# EAGLE design mcb_mini44 (EAGLE 5.09)
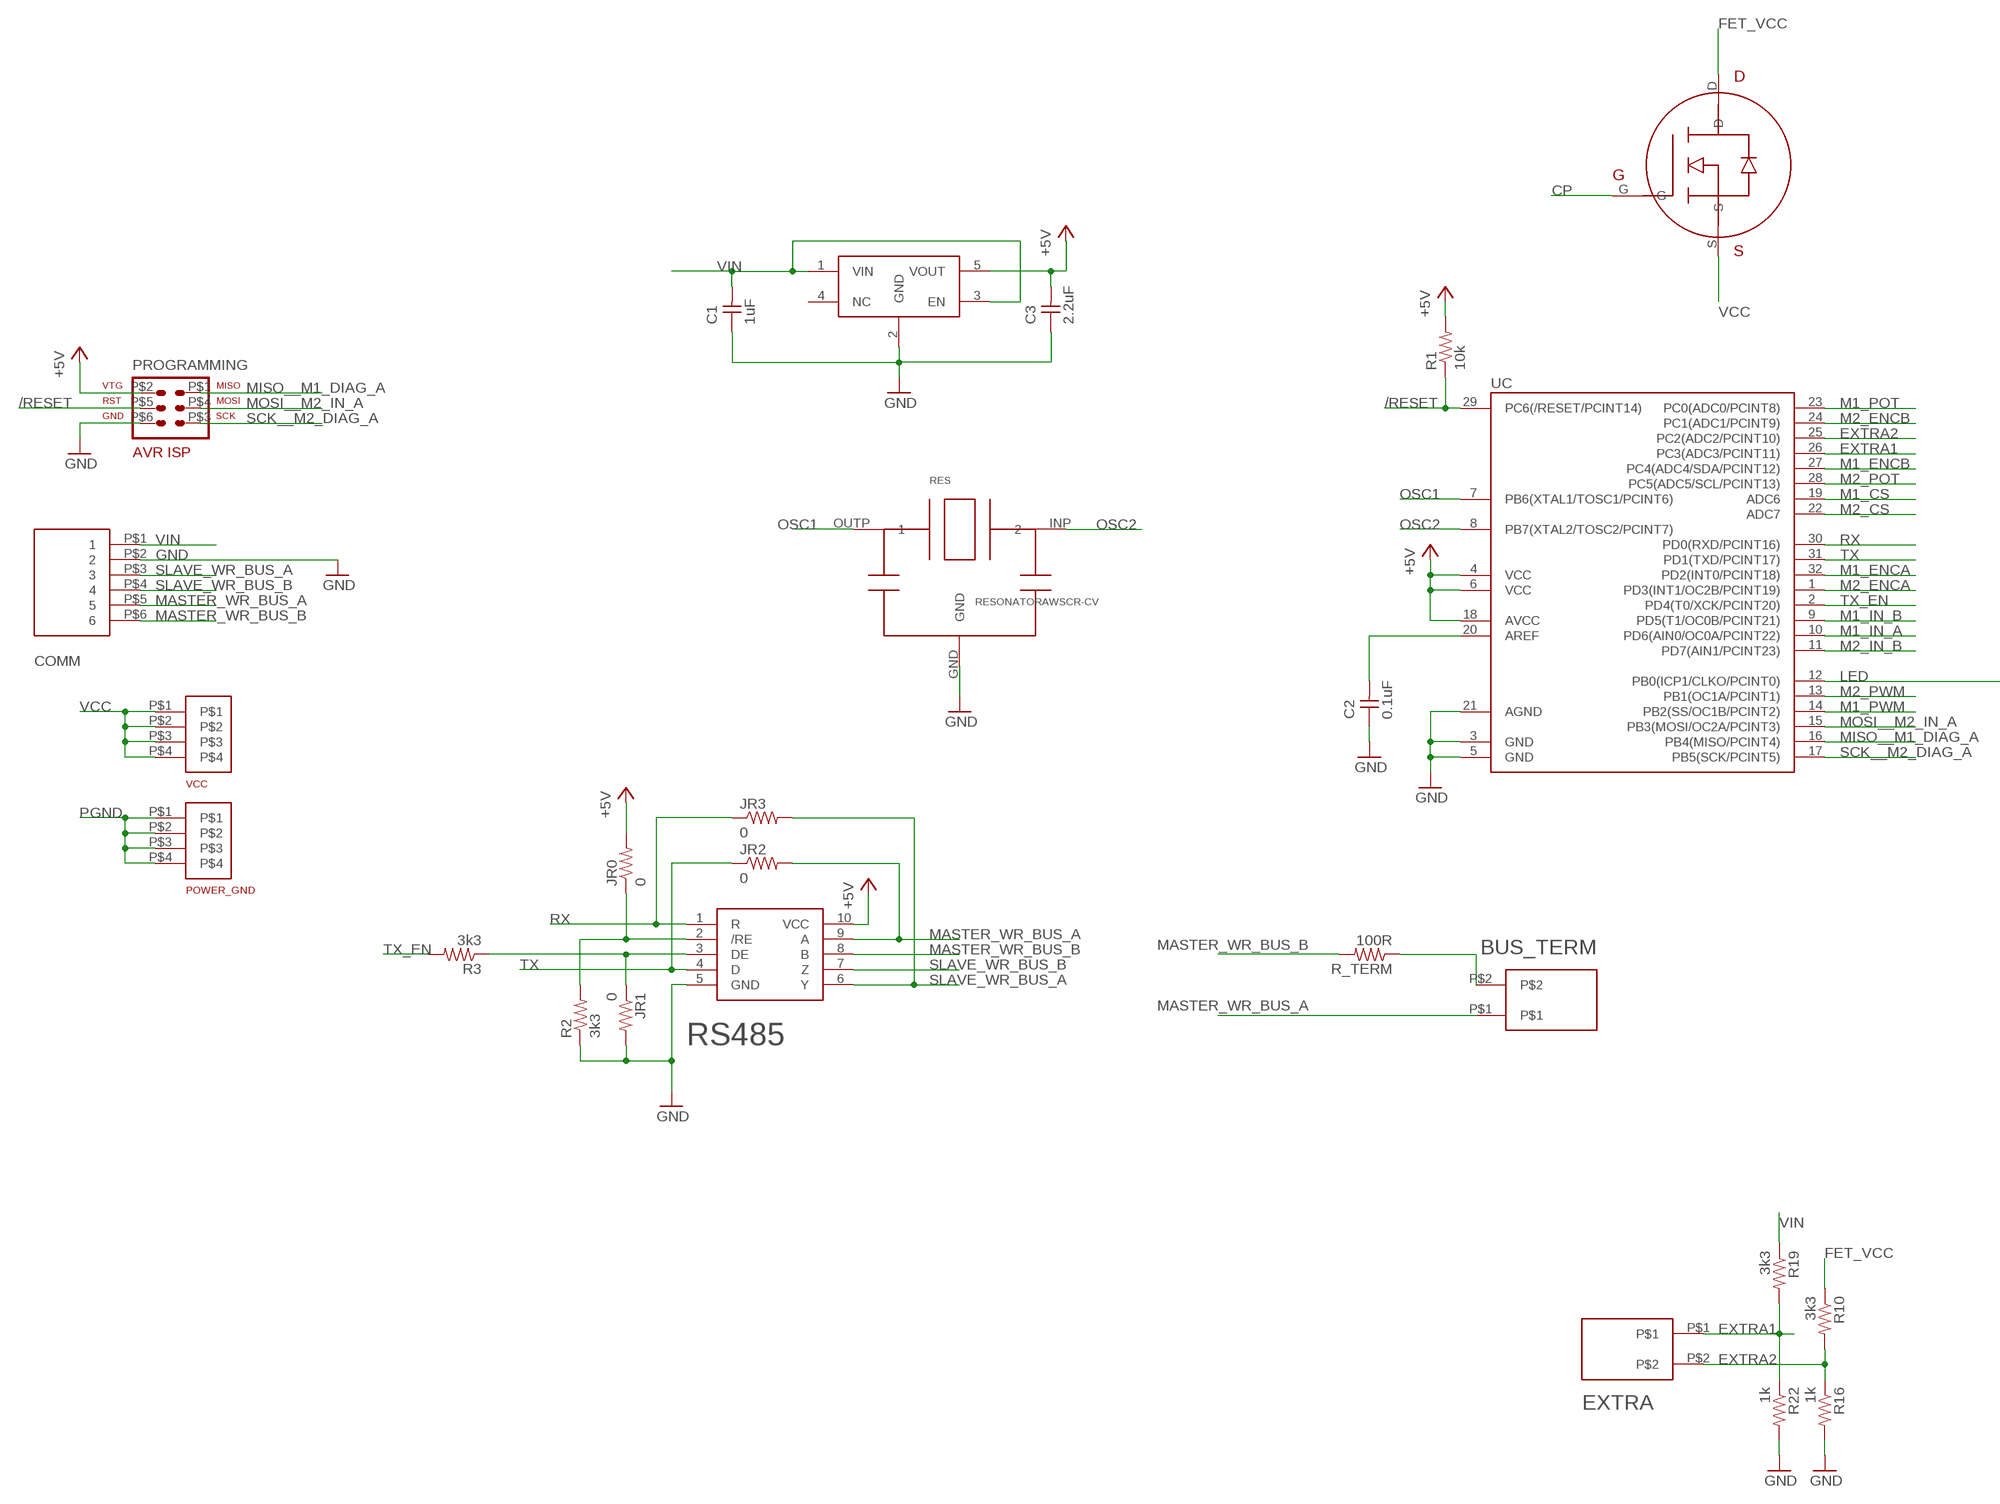
[diagram p0: schematic, sheet 1, part 1 of 2]
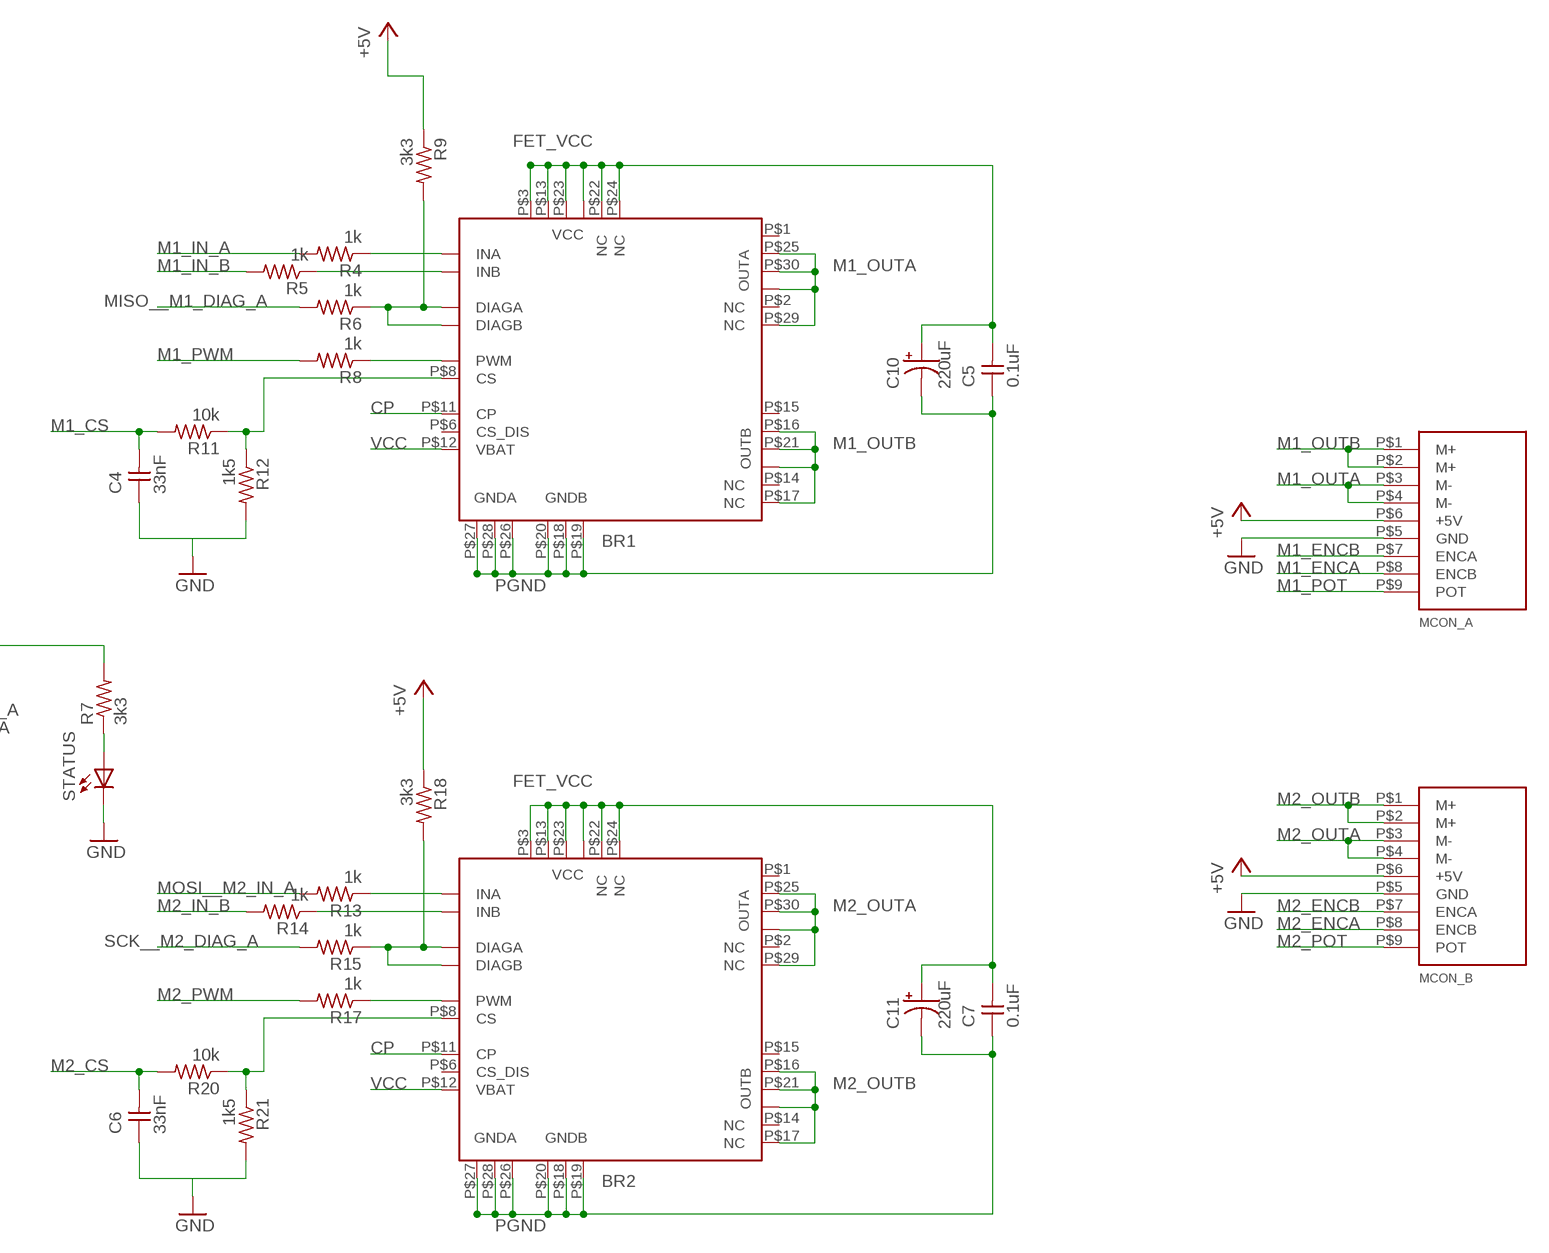
[diagram p1: schematic, sheet 1, part 2 of 2]

## Parts
BR1  VNH5019A-E  [MULTIPOWERSO-30-SIGGI]
BR2  VNH5019A-E  [MULTIPOWERSO-30-SIGGI]
BUS_TERM  2PIN-100MILL  [2-PIN-100MIL]
C1  1uF  CAPACITOR0603  [0603]
C2  0.1uF  CAPACITOR0603  [0603]
C3  2.2uF  CAPACITOR0603  [0603]
C4  33nF  CAPACITOR0603  [0603]
C5  0.1uF  CAPACITOR0603  [0603]
C6  33nF  CAPACITOR0603  [0603]
C7  0.1uF  CAPACITOR0603  [0603]
C10  220uF  CAP-EMVY350ADA221MHA0G  [HAO]
C11  220uF  CAP-EMVY350ADA221MHA0G  [HAO]
COMM  6PIN-RIBBONCABLE-BOARDHEADER  [6PIN-HEADER-DUALROW]
EXTRA  2PIN-100MILL  [2-PIN-100MIL]
FET  MOSFET-N-FDD8896  [TO-252]
JR0  0  RESISTOR0603  [0603]
JR1  0  RESISTOR0603  [0603]
JR2  0  RESISTOR0603  [0603]
JR3  0  RESISTOR0603  [0603]
MCON_A  9-PIN-MOTOR_CONNECTOR  [9-PIN-2.54MM-TERMINAL-BLOCK]
MCON_B  9-PIN-MOTOR_CONNECTOR  [9-PIN-2.54MM-TERMINAL-BLOCK]
POWER_GND  SCREW_TERMINAL_7700K  [SCREW_TERM_7700K]
PROGRAMMING  AVR-ISP-6SURFACE_MOUNT  [SMD6]
R1  10k  RESISTOR0603  [0603]
R2  3k3  RESISTOR0603  [0603]
R3  3k3  RESISTOR0603  [0603]
R4  1k  RESISTOR0603  [0603]
R5  1k  RESISTOR0603  [0603]
R6  1k  RESISTOR0603  [0603]
R7  3k3  RESISTOR0603  [0603]
R8  1k  RESISTOR0603  [0603]
R9  3k3  RESISTOR0603  [0603]
R10  3k3  RESISTOR0603  [0603]
R11  10k  RESISTOR0603  [0603]
R12  1k5  RESISTOR0603  [0603]
R13  1k  RESISTOR0603  [0603]
R14  1k  RESISTOR0603  [0603]
R15  1k  RESISTOR0603  [0603]
R16  1k  RESISTOR0603  [0603]
R17  1k  RESISTOR0603  [0603]
R18  3k3  RESISTOR0603  [0603]
R19  3k3  RESISTOR0603  [0603]
R20  10k  RESISTOR0603  [0603]
R21  1k5  RESISTOR0603  [0603]
R22  1k  RESISTOR0603  [0603]
R_TERM  100R  RESISTOR0603  [0603]
RES  RESONATORAWSCR-CV  [AWSCR-CV]
RS485  RS485-SN65HVD3086EDGSR  [MSOP-10]
STATUS  LED1206  [CHIPLED_1206]
UC  MEGA48/88/168-AU  [TQFP32-08]
VCC  SCREW_TERMINAL_7700K  [SCREW_TERM_7700K]
VREG  MIC5235  [SOT-23-5]

## Nets
+1.1V: C2.2 UC.20(AREF)
+5V: C3.2 JR0.2 MCON_A.P$6(+5V) MCON_B.P$6(+5V) PROGRAMMING.P$2 R1.2 R9.1 R18.1 RS485.10(VCC) UC.4(VCC) UC.6(VCC) UC.18(AVCC) VREG.5(VOUT)
/RESET: PROGRAMMING.P$5 R1.1 UC.29(PC6(/RESET/PCINT14))
CP: BR1.P$11(CP) BR2.P$11(CP) FET.G
EXTRA1: EXTRA.P$1 R19.2 R22.1 UC.26(PC3(ADC3/PCINT11))
EXTRA2: EXTRA.P$2 R10.2 R16.1 UC.25(PC2(ADC2/PCINT10))
FET_VCC: BR1.P$3(VCC) BR1.P$13(VCC) BR1.P$22(NC) BR1.P$23(VCC) BR1.P$24(NC) BR1.VCC_SLUG(VCC) BR2.P$3(VCC) BR2.P$13(VCC) BR2.P$22(NC) BR2.P$23(VCC) BR2.P$24(NC) BR2.VCC_SLUG(VCC) C5.2 C7.2 C10.+ C11.+ FET.D R10.1
GND: C1.1 C2.1 C3.1 C4.1 C6.1 COMM.P$2 JR1.2 MCON_A.P$5(GND) MCON_B.P$5(GND) PROGRAMMING.P$6 R2.1 R12.2 R16.2 R21.2 R22.2 RES.GND RS485.5(GND) STATUS.C UC.3(GND) UC.5(GND) UC.21(AGND) VREG.2(GND)
LED: R7.2 UC.12(PB0(ICP1/CLKO/PCINT0))
M1_CS: C4.2 R11.2 UC.19(ADC6)
M1_ENCA: MCON_A.P$8(ENCB) UC.32(PD2(INT0/PCINT18))
M1_ENCB: MCON_A.P$7(ENCA) UC.27(PC4(ADC4/SDA/PCINT12))
M1_IN_A: R4.2 UC.10(PD6(AIN0/OC0A/PCINT22))
M1_IN_B: R5.2 UC.9(PD5(T1/OC0B/PCINT21))
M1_OUTA: BR1.OUTA_SLUG(OUTA) BR1.P$25(OUTA) BR1.P$29(NC) BR1.P$30(OUTA) MCON_A.P$3(M-) MCON_A.P$4(M-)
M1_OUTB: BR1.OUTB_SLUG(OUTB) BR1.P$16(OUTB) BR1.P$17(NC) BR1.P$21(OUTB) MCON_A.P$1(M+) MCON_A.P$2(M+)
M1_POT: MCON_A.P$9(POT) UC.23(PC0(ADC0/PCINT8))
M1_PWM: R8.2 UC.14(PB2(SS/OC1B/PCINT2))
M2_CS: C6.2 R20.2 UC.22(ADC7)
M2_ENCA: MCON_B.P$8(ENCB) UC.1(PD3(INT1/OC2B/PCINT19))
M2_ENCB: MCON_B.P$7(ENCA) UC.24(PC1(ADC1/PCINT9))
M2_IN_B: R14.2 UC.11(PD7(AIN1/PCINT23))
M2_OUTA: BR2.OUTA_SLUG(OUTA) BR2.P$25(OUTA) BR2.P$29(NC) BR2.P$30(OUTA) MCON_B.P$3(M-) MCON_B.P$4(M-)
M2_OUTB: BR2.OUTB_SLUG(OUTB) BR2.P$16(OUTB) BR2.P$17(NC) BR2.P$21(OUTB) MCON_B.P$1(M+) MCON_B.P$2(M+)
M2_POT: MCON_B.P$9(POT) UC.28(PC5(ADC5/SCL/PCINT13))
M2_PWM: R17.2 UC.13(PB1(OC1A/PCINT1))
MASTER_WR_BUS_A: BUS_TERM.P$1 COMM.P$5 JR2.2 RS485.9(A)
MASTER_WR_BUS_B: COMM.P$6 R_TERM.2 RS485.8(B)
MISO__M1_DIAG_A: PROGRAMMING.P$1 R6.2 UC.16(PB4(MISO/PCINT4))
MOSI__M2_IN_A: PROGRAMMING.P$4 R13.2 UC.15(PB3(MOSI/OC2A/PCINT3))
N$2: BR2.P$4(INA) R13.1
N$3: JR0.1 R2.2 RS485.2(/RE)
N$4: JR1.1 R3.1 RS485.3(DE)
N$5: BR1.P$8(CS) R11.1 R12.1
N$6: BR2.P$10(INB) R14.1
N$8: BR2.P$5(DIAGA) BR2.P$9(DIAGB) R15.1 R18.2
N$9: BR2.P$7(PWM) R17.1
N$10: BR1.P$4(INA) R4.1
N$11: BR1.P$10(INB) R5.1
N$12: R7.1 STATUS.A
N$13: BR1.P$5(DIAGA) BR1.P$9(DIAGB) R6.1 R9.2
N$14: BR1.P$7(PWM) R8.1
N$15: BR2.P$8(CS) R20.1 R21.1
N$16: BUS_TERM.P$2 R_TERM.1
OSC1: RES.OUTP UC.7(PB6(XTAL1/TOSC1/PCINT6))
OSC2: RES.INP UC.8(PB7(XTAL2/TOSC2/PCINT7))
PGND: BR1.P$18(GNDB) BR1.P$19(GNDB) BR1.P$20(GNDB) BR1.P$26(GNDA) BR1.P$27(GNDA) BR1.P$28(GNDA) BR2.P$18(GNDB) BR2.P$19(GNDB) BR2.P$20(GNDB) BR2.P$26(GNDA) BR2.P$27(GNDA) BR2.P$28(GNDA) C5.1 C7.1 C10.- C11.- POWER_GND.P$1 POWER_GND.P$2 POWER_GND.P$3 POWER_GND.P$4
RX: JR3.1 RS485.1(R) UC.30(PD0(RXD/PCINT16))
SCK__M2_DIAG_A: PROGRAMMING.P$3 R15.2 UC.17(PB5(SCK/PCINT5))
SLAVE_WR_BUS_A: COMM.P$3 JR3.2 RS485.6(Y)
SLAVE_WR_BUS_B: COMM.P$4 RS485.7(Z)
TX: JR2.1 RS485.4(D) UC.31(PD1(TXD/PCINT17))
TX_EN: R3.2 UC.2(PD4(T0/XCK/PCINT20))
VCC: BR1.P$12(VBAT) BR2.P$12(VBAT) FET.S VCC.P$1 VCC.P$2 VCC.P$3 VCC.P$4
VIN: C1.2 COMM.P$1 R19.1 VREG.1(VIN) VREG.3(EN)
Unconnected: BR1.P$1(OUTA) BR1.P$2(NC) BR1.P$6(CS_DIS) BR1.P$14(NC) BR1.P$15(OUTB) BR2.P$1(OUTA) BR2.P$2(NC) BR2.P$6(CS_DIS) BR2.P$14(NC) BR2.P$15(OUTB) VREG.4(NC)

## Library data of the parts
BR1 BR2 = st-microelectronics:VNH5019A-E
BUS_TERM EXTRA = soa:2PIN-100MILL
C1-C7 = huggable:CAPACITOR
C10 C11 = soa:CAP-EMVY350ADA221MHA0G
COMM = soa:6PIN-RIBBONCABLE-BOARDHEADER
FET = soa:MOSFET-N-FDD8896
JR0 JR1-JR3 R1-R22 R_TERM = huggable:RESISTOR
MCON_A MCON_B = soa:9-PIN-MOTOR_CONNECTOR
POWER_GND VCC = soa:SCREW_TERMINAL_7700K
PROGRAMMING = avr-4:AVR-ISP-6: AVR ISP-6 Serial Programming Header
RES = soa:RESONATOR
RS485 = soa:RS485-SN65HVD3086EDGSR
STATUS = huggable:LED
UC = avr-4:MEGA48/88/168
VREG = soa:MIC5235

## Board
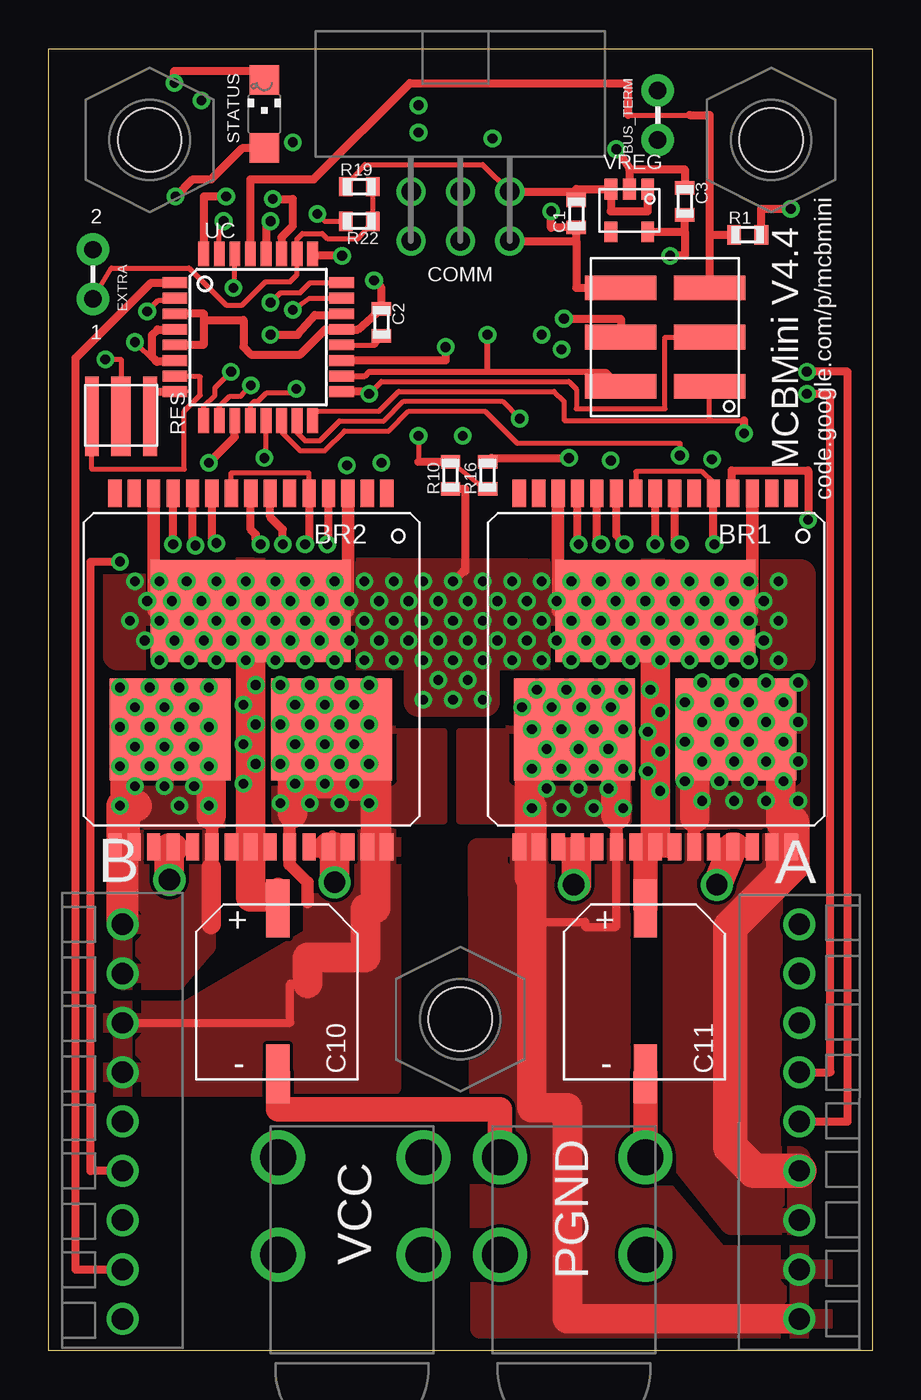
[diagram p2: board, top side]
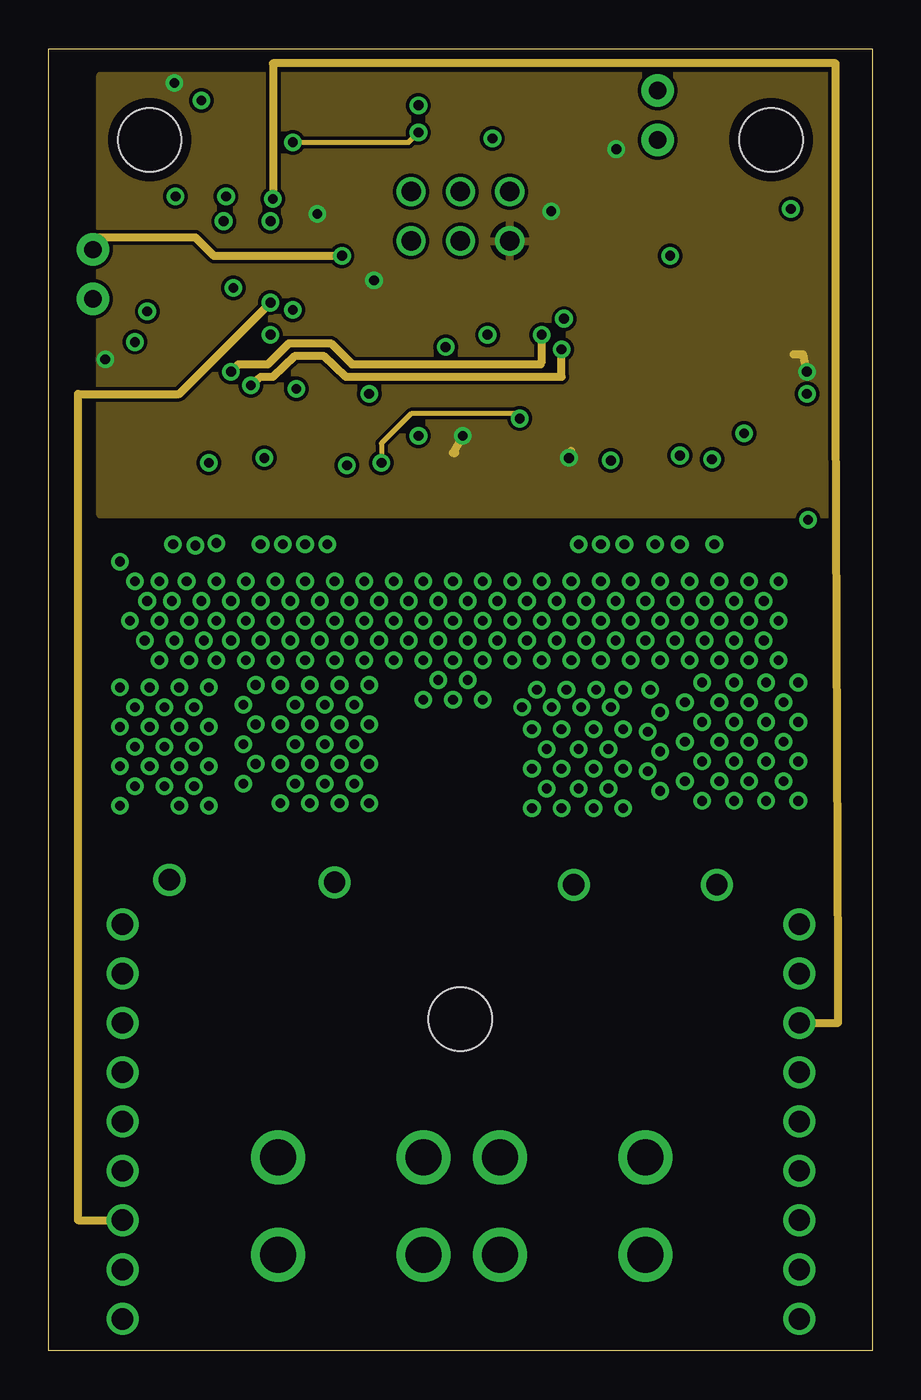
[diagram p3: board, inner layer SIGNAL]
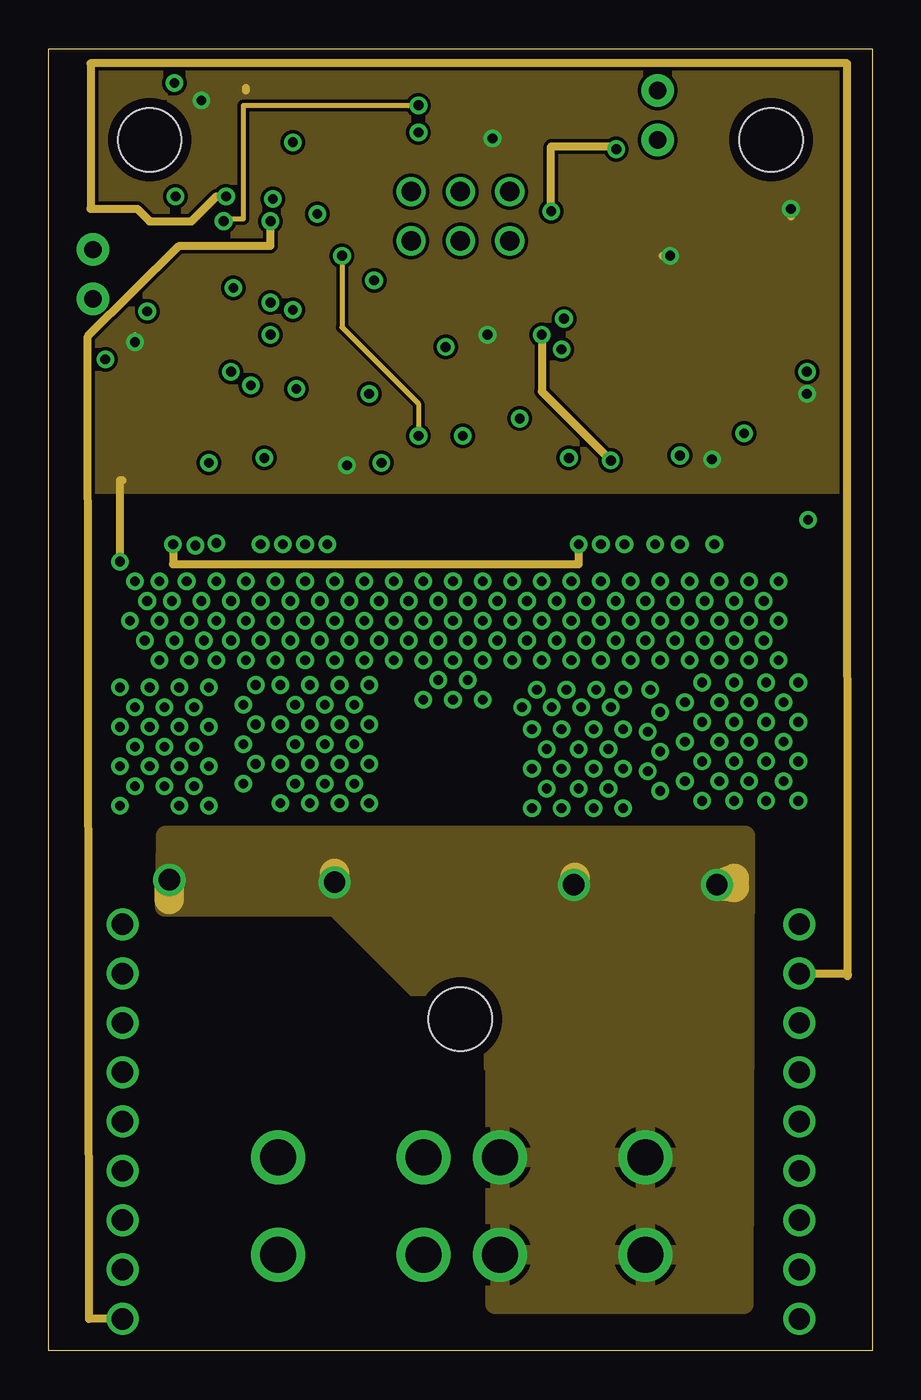
[diagram p4: board, inner layer VCC]
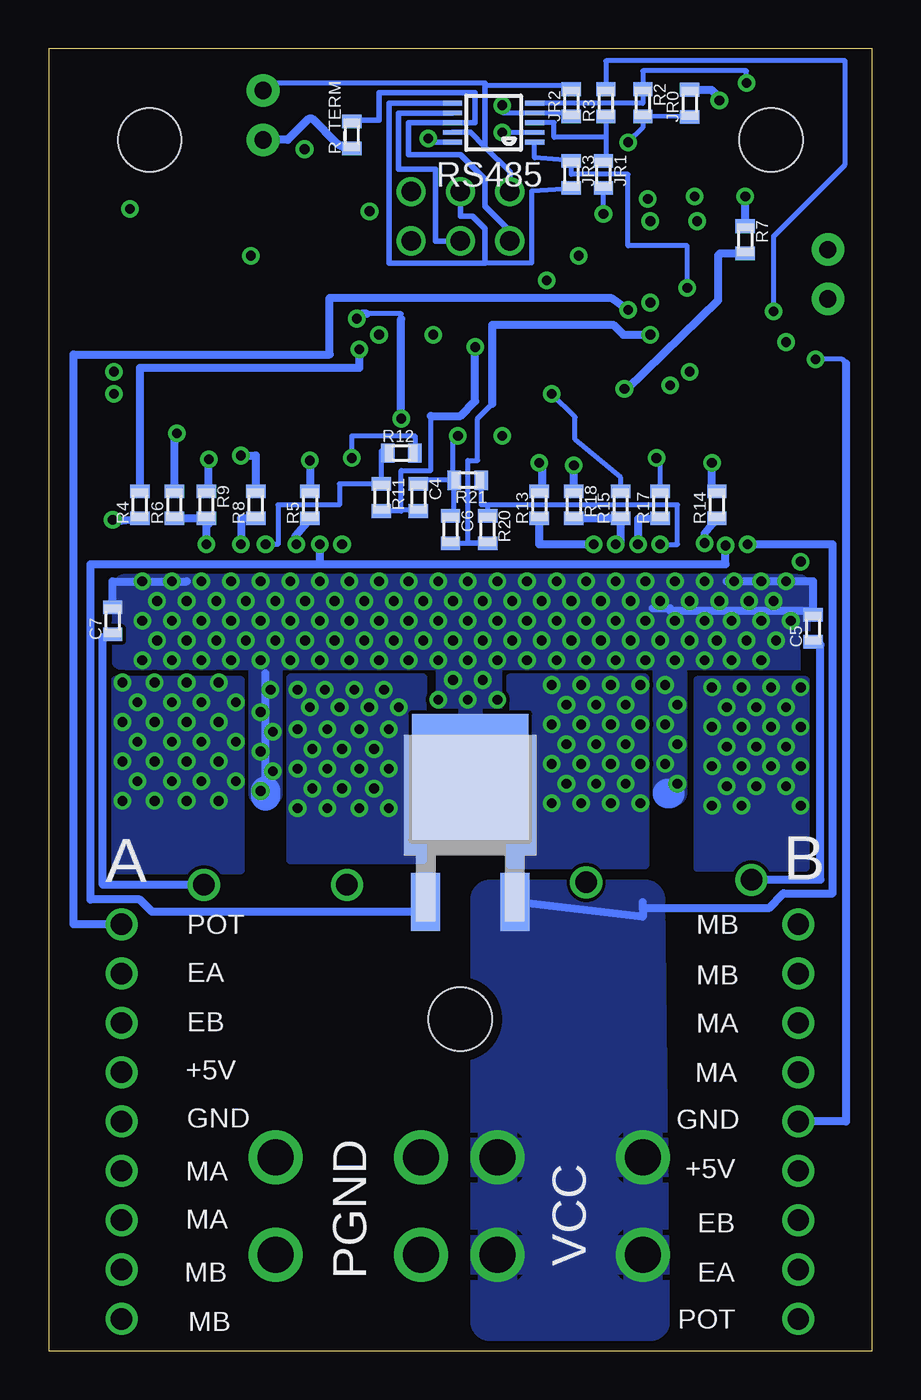
[diagram p5: board, bottom side, seen from below]

Size 42.42 x 67.06 mm. Coordinates in mm from the lower left corner, seen from the top.
Outline: 0,67.06 42.42,67.06 42.42,0 0,0 0,67.06
Copper layers (1*2+3*16): SIGNAL_TOP 0.0356mm / dielectric 1.5011mm / SIGNAL 0.0356mm / dielectric 0.1499mm / VCC 0.0356mm / dielectric 0.2007mm / GND 0.0356mm
Design rules "SilverCircuits_DesignRules *": minimum track width 7mil, minimum drill 14mil, track to track 7mil, track to pad 7mil, pad to pad 7mil, via to via 7mil, smd to smd 0mil, copper to edge 20mil, drill to drill 8mil, minimum pad ring 10mil, minimum via ring 8mil, stop-mask expansion 4mil, vias tented up to drill 0mil, thermal gap 10mil

### Footprints (pad centres in the part's own frame; a part is rotated, then mirrored left to right if it is on the bottom)
MULTIPOWERSO-30-SIGGI = smd 6.23 x 5.25: OUTA_SLUG -4.15,3.05; OUTB_SLUG 4.15,3.05 | smd 0.68 x 1.4: P$1 -7,-9.1; P$2 -6,-9.1; P$3 -5,-9.1; P$4 -4,-9.1; P$5 -3,-9.1; P$6 -2,-9.1; P$7 -1,-9.1; P$8 0,-9.1; P$9 1,-9.1; P$10 2,-9.1; P$11 3,-9.1; P$12 4,-9.1; P$13 5,-9.1; P$14 6,-9.1; P$15 7,-9.1; P$16 7,9.1; P$17 6,9.1; P$18 5,9.1; P$19 4,9.1; P$20 3,9.1; P$21 2,9.1; P$22 1,9.1; P$23 0,9.1; P$24 -1,9.1; P$25 -2,9.1; P$26 -3,9.1; P$27 -4,9.1; P$28 -5,9.1; P$29 -6,9.1; P$30 -7,9.1 | smd 10.3 x 5.25: VCC_SLUG 0,-3.05
2-PIN-100MIL = drill 0.889 pad 1.676 round: P$1 0,0; P$2 2.54,0
0603 = smd 0.7 x 1: 1 -0.7,0; 2 0.7,0
HAO = smd 1.2 x 3: + 0,5; - 0,-3.5
6PIN-HEADER-DUALROW = drill 1 round: P$1 -2.54,0; P$2 -2.54,2.54; P$3 0,0; P$4 0,2.54; P$5 2.54,0; P$6 2.54,2.54
TO-252 = smd 6 x 6.5: D 0,6.44 | smd 1.5 x 3: G -2.3,0; S 2.3,0
9-PIN-2.54MM-TERMINAL-BLOCK = drill 1.1 round: P$1 0,0; P$2 2.54,0; P$3 5.08,0; P$4 7.62,0; P$5 10.16,0; P$6 12.7,0; P$7 15.24,0; P$8 17.78,0; P$9 20.32,0
SCREW_TERM_7700K = drill 1.854 round: P$1 -3.81,2.032; P$2 3.683,2.032; P$3 -3.81,-2.972; P$4 3.683,-2.972
SMD6 = smd 3.68 x 1.27: P$1 -2.286,2.54; P$2 2.286,2.54; P$3 -2.286,0; P$4 2.286,0; P$5 -2.286,-2.54; P$6 2.286,-2.54
AWSCR-CV = smd 1 x 4.1: GND 0,0 | smd 0.7 x 4.1: INP -1.5,0; OUTP 1.5,0
MSOP-10 = smd 0.25 x 1: 1 -0.88,-2.423; 2 -0.38,-2.423; 3 0.12,-2.423; 4 0.62,-2.423; 5 1.12,-2.423; 6 1.12,1.803; 7 0.62,1.803; 8 0.12,1.803; 9 -0.38,1.803; 10 -0.88,1.803
CHIPLED_1206 = smd 1.5 x 1.5: A 0,-1.75; C 0,1.75
4-40_NUT_DRILL = hole 3.264: 0,0
TQFP32-08 = smd 1.27 x 0.559: 1 -4.293,2.8; 2 -4.293,2; 3 -4.293,1.2; 4 -4.293,0.4; 5 -4.293,-0.4; 6 -4.293,-1.2; 7 -4.293,-2; 8 -4.293,-2.8; 17 4.293,-2.8; 18 4.293,-2; 19 4.293,-1.2; 20 4.293,-0.4; 21 4.293,0.4; 22 4.293,1.2; 23 4.293,2; 24 4.293,2.8 | smd 0.559 x 1.27: 9 -2.8,-4.293; 10 -2,-4.293; 11 -1.2,-4.293; 12 -0.4,-4.293; 13 0.4,-4.293; 14 1.2,-4.293; 15 2,-4.293; 16 2.8,-4.293; 25 2.8,4.293; 26 2,4.293; 27 1.2,4.293; 28 0.4,4.293; 29 -0.4,4.293; 30 -1.2,4.293; 31 -2,4.293; 32 -2.8,4.293
SOT-23-5 = smd 0.65 x 1.06: 1 0,0; 2 0.95,0; 3 1.9,0; 4 1.9,2.2; 5 0,2.2

### Placement (x,y rotation side)
BR1  31.24,35.05 180 top
BR2  10.41,35.05 180 top
BUS_TERM  31.37,64.9 270 top
C1  27.18,58.55 90 top
C2  17.14,52.96 270 top
C3  32.77,59.18 270 top
C4  23.37,43.94 270 bottom
C5  3.05,37.21 90 bottom
C6  21.72,42.29 270 bottom
C7  39.12,37.59 90 bottom
C10  11.81,17.78 0 top
C11  30.73,17.78 0 top
COMM  21.21,59.69 180 top
EXTRA  2.29,54.17 90 top
FET  20.7,23.11 0 bottom
JR0  9.4,64.24 90 bottom
JR1  13.84,60.58 270 bottom
JR2  15.49,64.26 90 bottom
JR3  15.49,60.58 270 bottom
MCON_A  38.66,1.65 90 top
MCON_B  3.81,21.97 270 top
POWER_GND  26.92,6.98 180 top
PROGRAMMING  31.75,52.2 180 top
R1  36,57.47 0 top
R2  11.81,64.26 270 bottom
R3  13.72,64.26 90 bottom
R4  37.72,43.56 90 bottom
R5  28.96,43.56 90 bottom
R6  35.94,43.56 90 bottom
R7  6.54,57.21 270 bottom
R8  31.75,43.56 90 bottom
R9  34.29,43.56 270 bottom
R10  20.7,45.08 90 top
R11  25.27,43.94 270 bottom
R12  24.26,46.23 0 bottom
R13  17.14,43.56 90 bottom
R14  8,43.56 90 bottom
R15  12.95,43.56 90 bottom
R16  22.61,45.08 90 top
R17  10.92,43.56 90 bottom
R18  15.37,43.56 270 bottom
R19  16,59.94 0 top
R20  19.81,42.29 270 bottom
R21  20.83,44.83 180 bottom
R22  16,58.17 180 top
R_TERM  26.8,62.61 90 bottom
RES  3.73,48.12 180 top
RS485  19.81,63.12 90 bottom
STATUS  11.11,63.69 0 top
U$3  [4-40_NUT_DRILL]  21.21,17.09 0 top
U$10  [4-40_NUT_DRILL]  5.21,62.36 0 top
U$14  [4-40_NUT_DRILL]  37.21,62.36 0 top
UC  10.8,52.2 0 top
VCC  15.49,6.98 180 top
VREG  30.86,59.82 180 top

### Tracks (layer width: path | path; a pad name or v marks a point on that pad's centre or on a via)
+1.1V
  SIGNAL_TOP 0.254: UC.20 16.83,51.8 C2.2
+5V  (via drill 0.5)
  SIGNAL_TOP 0.254: 6.43,50.93 5.46,50.93 v4.45,51.94
  SIGNAL_TOP 0.305: PROGRAMMING.P$2 28.7,50.42 22.61,50.42 | 22.61,50.42 v22.61,52.32 | UC.18 16.29,50.2 16.51,50.42 22.61,50.42
  SIGNAL_TOP 0.406: 32.77,57.62 C3.2 | VREG.5 32.77,57.62 | MCON_A.P$6 40.26,14.35 40.26,49.28 v39.05,49.28 | MCON_B.P$6 2.16,9.27 2.16,40.64 v3.68,40.64 | UC.4 5.61,52.6 5.33,52.32 5.33,51.18 5.59,50.93 6.43,50.93 UC.6 | R1.2 36.7,58.8 v38.23,58.8 | 32.77,57.62 32.77,56.39 v32,56.39
  VCC 0.254: v4.45,51.94 4.45,52.32
  VCC 0.279: v22.86,62.42 22.61,62.48
  VCC 0.305: v22.61,52.32 22.86,52.32
  VCC 0.406: v15.37,45.59 15.37,45.72 | v34.16,45.91 34.16,45.85 | v38.23,58.8 38.23,58.42 | v32,56.39 31.62,56.39 | 10.16,65.02 10.16,64.9 | v3.68,40.64 3.68,44.83 3.81,44.83 | v39.05,49.28 39.12,49.53
  GND 0.279: RS485.10 22.86,62.24 v22.86,62.42
  GND 0.406: R18.1 v15.37,45.59 | R9.1 34.16,44.41 v34.16,45.91 | JR0.2 8.28,64.93 7.87,64.53 v7.87,64.39
  pour VCC: 1.52,66.04 41.02,66.04 41.02,44.32 1.52,44.32
/RESET
  SIGNAL_TOP 0.254: 29.85,63.63 33.02,63.63
  SIGNAL_TOP 0.406: UC.29 10.39,60.33 13.65,60.33 18.61,65.28 29.72,65.28 29.85,65.15 | 34.04,57.47 PROGRAMMING.P$5 | 34.04,57.47 R1.1 | 29.85,65.15 29.85,63.63 | 29.85,65.15 29.85,65.28 | 33.02,63.63 34.04,63.63 34.04,57.47
CP  (via drill 0.5)
  SIGNAL_TOP 0.406: 7.37,44.15 BR2.P$11 7.41,41.53 v7.56,41.47 | BR1.P$11 28.24,41.53 v28.45,41.53
  GND 0.406: 23,23.24 FET.G 23,22.61 37.08,22.61 37.72,23.24 40.26,23.24 40.26,40.51 28.45,40.51 | 28.45,40.51 7.56,40.51 v7.56,41.47 | 28.45,40.51 v28.45,41.53
EXTRA1
  SIGNAL_TOP 0.254: EXTRA.P$1 3.24,55.75 7.24,55.75 9.14,53.85 9.97,53.85 11.18,55.05 12.45,55.05 12.8,55.4 UC.26 12.8,57.24 13.08,57.53 14.1,57.53 14.35,57.28 15.96,57.28 R22.1 R19.2
EXTRA2  (via drill 0.5)
  SIGNAL_TOP 0.254: v19.05,47.12 19.05,45.78 | R10.2 22.48,44.39 R16.1
  SIGNAL_TOP 0.406: v15.11,56.39 13.7,56.39 UC.25 | 19.05,45.78 R10.2
  SIGNAL 0.406: v15.11,56.39 8.51,56.39 7.56,57.34 2.29,57.34 EXTRA.P$2
  VCC 0.254: 15.24,56.52 v15.11,56.39 15.11,52.7 19.05,48.77 v19.05,47.12
FET_VCC  (via drill 0.5)
  SIGNAL_TOP 0.406: v20.83,39.62 21.34,40.13 21.46,40.13 21.46,44.39 R10.1
  SIGNAL_TOP 0.508: BR2.P$24 BR2.P$23 10.41,25.78 | 11.81,23.37 11.18,23.37
  SIGNAL_TOP 0.635: 15.41,38.1 BR2.P$3 | BR2.P$13 5.41,38.1 BR2.VCC_SLUG | BR2.P$23 BR2.P$22 | 30.73,25.65 30.54,25.65 BR1.P$22 BR1.P$23 31.24,26.42 | BR1.P$24 31.92,25.95 31.88,25.91 | BR1.P$13 26.24,38.1 BR1.VCC_SLUG 36.24,38.1 BR1.P$3
  SIGNAL_TOP 1.016: 31.2,25.91 31.88,25.91 | 30.73,25.53 31.11,25.91 31.2,25.91 | 31.2,25.91 BR1.P$23 | C10.+ 11.81,23.37 11.81,23.88
  SIGNAL_TOP 1.27: C11.+ 30.73,25.53 30.73,25.65
  SIGNAL_TOP 1.524: 31.24,26.42 BR1.VCC_SLUG | BR2.P$23 BR2.VCC_SLUG | 10.41,25.78 10.41,23.37 11.18,23.37
  GND 0.406: 31.24,28.83 31.24,34.89 | 7.49,39.62 v7.11,39.62 v5.71,39.62 v4.45,39.62 3.05,39.62 C5.2 3.18,38.1 BR2.VCC_SLUG 10.41,38.23 11.3,38.23 | C7.2 39.12,39.62 v37.59,39.62 35.31,39.62
  GND 1.524: 31.24,28.83 31.24,28.57 | 10.41,28.7 10.54,28.7
  GND 2.54: 20.7,28.7 FET.D 20.7,28.83
  other vias: 5.08,38.61 6.35,38.61 8.64,39.62 9.4,38.61 7.87,38.61 11.68,39.62 13.21,39.62 13.97,38.61 12.45,38.61 10.92,38.61 10.16,39.62 5.71,37.59 7.24,37.59 8,36.58 6.48,36.58 4.95,36.58 4.19,37.59 16.26,39.62 17.78,39.62 18.54,38.61 17.02,38.61 15.49,38.61 14.73,39.62 22.35,39.62 23.11,38.61 21.59,38.61 20.07,38.61 19.3,39.62 19.3,37.59 20.83,37.59 21.59,36.58 20.07,36.58 18.54,36.58 17.78,37.59 14.73,37.59 16.26,37.59 17.02,36.58 15.49,36.58 13.97,36.58 13.21,37.59 10.16,37.59 11.68,37.59 12.45,36.58 10.92,36.58 9.4,36.58 8.64,37.59 25.4,39.62 26.92,39.62 27.69,38.61 26.16,38.61 24.64,38.61 23.88,39.62 23.88,37.59 25.4,37.59 26.16,36.58 24.64,36.58 23.11,36.58 22.35,37.59 28.45,37.59 29.97,37.59 30.73,36.58 29.21,36.58 27.69,36.58 26.92,37.59 33.02,37.59 34.54,37.59 35.31,36.58 33.78,36.58 32.26,36.58 31.5,37.59 29.97,39.62 31.5,39.62 32.26,38.61 30.73,38.61 29.21,38.61 28.45,39.62 34.54,39.62 36.07,39.62 36.83,38.61 35.31,38.61 33.78,38.61 33.02,39.62 36.07,37.59 37.59,37.59 37.59,35.56 36.83,36.58 36.07,35.56 34.54,35.56 33.02,35.56 5.71,35.56 7.24,35.56 13.21,35.56 11.68,35.56 10.16,35.56 8.64,35.56 19.3,35.56 17.78,35.56 16.26,35.56 14.73,35.56 25.4,35.56 23.88,35.56 22.35,35.56 20.83,35.56 31.5,35.56 29.97,35.56 28.45,35.56 26.92,35.56 10.67,34.29 10.03,33.27 10.67,32.26 10.03,31.24 10.67,30.23 10.03,29.21 20.07,34.54 21.59,34.54 19.3,33.53 20.83,33.53 22.35,33.53 30.99,34.04 31.5,32.89 30.86,31.88 31.5,30.86 30.86,29.85 31.5,28.83
  pour GND: 3.81,35.69 3.81,39.37 38.48,39.37 38.61,35.69 31.5,35.69 31.5,28.7 30.99,28.7 30.99,35.69 21.84,35.69 21.84,31.5 19.68,31.5 19.68,35.69 10.67,35.69 10.67,28.7 10.16,28.7 10.16,35.69
  pour SIGNAL_TOP: 3.56,40.13 38.73,40 38.73,35.69 22.48,35.81 22.48,33.4 19.05,33.4 19.05,35.81 3.56,35.81
GND  (via drill 0.5, 0.51)
  SIGNAL_TOP 0.254: RES.GND 3.73,51.05 v2.92,51.05 | R22.2 14.22,58.17 v13.84,58.55
  SIGNAL_TOP 0.406: C3.1 32.77,60.83 29.95,60.83 | 27.18,57.15 C1.1 25.88,57.82 v25.88,58.67 | COMM.P$2 27.18,57.15 | VREG.2 29.91,60.83 29.95,60.83 | PROGRAMMING.P$6 27.18,54.74 27.18,57.15 | 6.5,51.84 UC.5 6.5,51.82 8,51.82 8,53.09 | v29.24,61.87 29.95,60.83 | UC.21 15.09,52.58 | MCON_A.P$5 41.15,11.81 41.15,50.42 v39.05,50.42 | UC.3 8,53.4 8,53.09 | UC.21 14.24,52.6 12.95,51.31 10.41,51.31 10.03,51.69 10.03,53.09 8,53.09 | v16.76,55.12 17.14,54.74 C2.1 15.93,52.6 UC.21 | 6.54,65.28 v6.48,65.28 6.48,65.91 11.11,65.91 STATUS.C | R16.2 22.8,45.97 v26.8,45.97
  SIGNAL 0.254: v16.76,55.12 16.64,55.12 16.51,55.24 | v13.84,58.55 14.1,58.55 | v6.48,65.28 6.48,65.15
  SIGNAL 0.406: v39.05,50.42 38.86,51.31 38.35,51.31 | v21.34,47.12 20.83,46.23 20.96,46.23 | v26.8,45.97 26.92,46.1 26.92,46.36
  VCC 0.406: v25.88,58.67 25.88,62.03 29.26,62.03 29.26,61.82 v29.24,61.87
  GND 0.254: RS485.5 11.81,64.24 R2.1 11.81,65.91 6.48,65.91 v6.48,65.28 | v13.84,58.55 JR1.2 | 1.35,50.85 1.55,51.05 v2.92,51.05 | C6.1 21.53,42.99 R21.2 | C4.1 23.37,44.83 21.59,44.83 21.59,47.12 v21.34,47.12 | R12.2 23.56,47.12 26.8,47.12 v26.8,45.97
  GND 0.406: MCON_B.P$5 1.35,11.81 1.35,50.85 | R21.2 21.59,44.83
  pour SIGNAL: 2.67,44.45 2.67,65.66 18.67,65.66 40.64,65.66 40.64,43.05 2.67,43.05
LED  (via drill 0.5)
  SIGNAL_TOP 0.254: UC.12 10.39,48.69 10.61,48.89 10.8,48.89 11.24,49.34 12.57,49.34 v12.76,49.53
  GND 0.406: v12.76,49.53 12.64,49.53 7.94,54.1 7.94,56.41 7.84,56.52 R7.2
M1_CS  (via drill 0.5)
  SIGNAL_TOP 0.406: v20.45,51.69 20.45,51 UC.19
  GND 0.254: 22.73,48.13 22.73,45.34 24.26,45.34 24.26,43.31 | 24.26,43.31 23.37,43.31 C4.2 | R11.2 24.26,43.24 24.26,43.31
  GND 0.406: v20.45,51.69 20.45,48.89 21.21,48.13 22.73,48.13
M1_ENCA  (via drill 0.5)
  SIGNAL_TOP 0.406: v9.14,59.44 8,59.44 UC.32
  VCC 0.254: v9.14,59.44 8.83,59.44
  VCC 0.406: MCON_A.P$8 41.15,19.43 41.15,19.3 41.12,50.04 41.12,66.29 2.16,66.29 2.16,58.8 4.57,58.8 5.21,58.17 7.37,58.17 8.64,59.44 v9.14,59.44
M1_ENCB  (via drill 0.5)
  SIGNAL_TOP 0.406: v11.56,59.31 12.57,59.31 12.57,57.91 12,57.33 UC.27
  SIGNAL 0.406: v11.56,59.31 11.56,66.29 40.54,66.29 40.54,48.77 40.67,19.43 40.67,16.89 MCON_A.P$7
M1_IN_A  (via drill 0.5)
  SIGNAL_TOP 0.254: UC.10 8.79,48.61 9.34,49.15 9.91,49.15 v10.41,49.72
  SIGNAL 0.406: v10.41,49.72 10.92,50.16 11.56,50.16 12.7,51.24 14.16,51.24 15.3,50.16 26.42,50.16 v26.42,51.56
  GND 0.406: R4.2 37.72,50.61 26.42,50.61 v26.42,51.56
M1_IN_B  (via drill 0.5)
  SIGNAL_TOP 0.254: UC.9 8,48.64 8.57,49.21 8.57,49.59 v9.4,50.42
  SIGNAL 0.406: v9.4,50.42 9.78,50.8 11.3,50.8 12.38,51.88 14.54,51.88 15.62,50.8 25.34,50.8 25.4,50.93 v25.4,52.32
  VCC 0.406: v28.96,45.85 25.4,49.4 v25.4,52.32
  GND 0.406: v28.96,45.85 R5.2
M1_OUTA  (via drill 0.5)
  SIGNAL_TOP 0.508: BR1.P$29 37.72,25.95 37.72,27.18
  SIGNAL_TOP 0.635: BR1.P$25 33.24,27.43 33.27,27.43
  SIGNAL_TOP 1.016: BR1.P$30 37.72,25.95 37.51,25.95 37.47,25.91 37.47,24.38
  SIGNAL_TOP 1.524: 33.27,27.43 33.27,32 BR1.OUTA_SLUG 37.72,32 37.72,27.18
  SIGNAL_TOP 1.778: MCON_A.P$4 36.32,9.27 35.12,10.48 35.12,21.84 38.29,25.02 38.29,27.18
  other vias: 36.96,34.42 38.61,34.42 37.85,33.4 36.07,33.4 33.66,30.35 35.31,30.35 34.54,29.34 32.77,29.34 33.66,28.32 35.31,28.32 36.96,28.32 38.61,28.32 36.96,30.35 38.61,30.35 37.85,29.34 36.07,29.34 36.96,32.39 38.61,32.39 37.85,31.37 36.07,31.37 33.66,32.39 35.31,32.39 34.54,31.37 32.77,31.37 33.66,34.42 35.31,34.42 34.54,33.4 32.77,33.4
  pour SIGNAL_TOP: 35.18,6.6 32.26,10.29 32.26,26.04 37.21,26.04 37.08,9.91 38.61,9.91 38.73,6.6
  pour GND: 32.51,34.54 38.99,34.54 38.99,24.76 32.51,24.76
  pour SIGNAL_TOP: 32.51,34.42 38.99,34.42 38.99,24.64 32.51,24.64
M1_OUTB  (via drill 0.5)
  SIGNAL_TOP 0.406: BR1.P$21 29.24,21.84 27.62,21.84 27.62,22.1 24.77,22.1 24.77,24.38
  SIGNAL_TOP 0.508: BR1.P$16 BR1.P$17 24.77,25.95 24.77,26.8
  SIGNAL_TOP 0.635: BR1.P$21 29.24,27.3 29.21,27.56
  SIGNAL_TOP 1.524: 24.77,26.8 24.77,32 BR1.OUTB_SLUG 29.46,32 29.46,29.97 29.21,29.97 29.21,27.56 | 24.77,24.38 24.77,28 24.89,28 24.89,12.51 26.73,12.51 26.73,1.65 MCON_A.P$1
  other vias: 28.19,34.04 29.59,34.04 28.96,33.15 27.43,33.15 25.15,34.04 26.67,34.04 25.91,33.15 24.38,33.15 24.89,32 26.42,32 25.65,30.99 28.07,32 29.59,32 28.83,30.99 27.31,30.99 28.07,29.97 29.59,29.97 28.83,28.96 27.31,28.96 24.89,29.97 26.42,29.97 25.65,28.96 26.42,27.94 28.07,27.94 29.59,27.94 24.89,27.94
  pour SIGNAL_TOP: 39.88,4.95 34.54,4.95 29.46,10.92 29.46,25.91 22.1,25.91 22.23,1.14 39.88,1.14
  pour SIGNAL_TOP: 23.75,34.42 29.85,34.42 29.85,27.3 21.21,27.3 21.21,31.88 23.75,31.88
  pour GND: 23.11,34.67 29.97,34.67 29.97,25.27 23.11,25.27
M1_POT  (via drill 0.5)
  SIGNAL_TOP 0.254: v12.57,53.59 13.43,54.2 UC.23
  GND 0.381: 41.12,42.29 41.12,42.16
  GND 0.406: MCON_A.P$9 41.12,21.97 41.12,42.29 41.12,51.31 27.94,51.31 27.94,54.23 13.46,54.23 v12.57,53.59
M1_PWM  (via drill 0.5)
  SIGNAL_TOP 0.254: UC.14 12,47.31 12.95,46.36 14.22,46.36 15.24,47.37 17.53,47.37 18.54,48.39 22.48,48.39 24.13,46.74 32.51,46.74 v32.51,46.1
  GND 0.406: R8.2 31.75,46.1 v32.51,46.1
M2_CS  (via drill 0.5)
  SIGNAL_TOP 0.406: v11.43,52.32 12.83,52.32 13.72,53.34 15.03,53.34 UC.22
  GND 0.254: 19.56,48.77 20.32,48.01 20.32,45.85 20.83,45.85 20.83,41.59 R20.2 C6.2
  GND 0.406: v11.43,52.32 12.83,52.32 13.34,52.83 19.56,52.83 19.56,48.77
M2_ENCA
  SIGNAL_TOP 0.406: MCON_B.P$8 1.4,4.19 1.4,51.12 5.28,55 UC.1
M2_ENCB  (via drill 0.5)
  SIGNAL_TOP 0.254: v11.43,53.97 11.94,54.48 12.95,54.48 13.47,55 UC.24
  SIGNAL 0.406: v11.43,53.97 6.73,49.28 1.52,49.28 1.52,6.73 MCON_B.P$7
M2_IN_B  (via drill 0.5)
  SIGNAL_TOP 0.406: v8.26,45.72 9.6,47.06 UC.11
  GND 0.406: R14.2 8.26,44.41 v8.26,45.72
M2_OUTA  (via drill 0.5)
  SIGNAL_TOP 0.406: 16.89,26.04 16.41,26.04 BR2.P$29 BR2.P$30 | 13.34,18.92 12.45,18.92 12.45,16.89 MCON_B.P$3
  SIGNAL_TOP 0.635: 12.57,27.69 arc90 12.41,27.53 BR2.P$25 12.41,25.05 13.34,24.13 13.34,23.11
  SIGNAL_TOP 1.524: 12.57,27.69 12.57,30.01 arc-90 BR2.OUTA_SLUG 16.89,32 16.89,26.04 | 13.34,18.92 13.34,20.26 16.32,20.26 16.32,22.8 16.83,22.8 16.83,29.08 14.99,29.08 14.99,29.21 v12.7,29.21
  other vias: 11.94,34.29 13.46,34.29 12.7,33.27 11.94,30.23 13.46,30.23 13.46,28.19 11.94,28.19 16.51,28.19 16.51,30.23 16.51,32.26 16.51,34.29 14.99,34.29 14.22,33.27 15.75,33.27 14.99,32.26 11.94,32.26 13.46,32.26 12.7,31.24 14.22,31.24 15.75,31.24 14.99,30.23 14.22,29.21 15.75,29.21 14.99,28.19
  pour SIGNAL_TOP: 3.3,17.53 7.11,17.53 13.59,21.34 13.59,26.29 17.65,26.42 17.65,13.59 3.3,13.59
  pour SIGNAL_TOP: 11.68,28.83 11.68,34.42 17.65,34.42 17.65,31.88 20.32,31.88 20.32,27.3 11.94,27.3 11.68,27.3
  pour GND: 11.68,34.67 18.67,34.67 18.67,25.02 11.68,25.02
M2_OUTB  (via drill 0.5)
  SIGNAL_TOP 0.406: BR2.P$17 arc90 4.33,26.04 3.94,26.04 | BR2.P$16 arc-90 3.75,26.29 3.94,26.54 | 4.51,28.07 v3.68,28.07
  SIGNAL_TOP 0.508: 8.38,24.89 8.41,24.89 BR2.P$21
  SIGNAL_TOP 0.635: BR2.P$21 8.41,27.53 arc90 8.38,27.56
  SIGNAL_TOP 1.016: 8.38,24.89 8.38,21.97
  SIGNAL_TOP 1.524: 3.94,26.04 3.94,26.54 3.94,29.68 arc-90 BR2.OUTB_SLUG arc-90 8.38,29.88 8.38,27.56
  SIGNAL_TOP 1.651: MCON_B.P$1 3.81,28.07 4.51,28.07
  other vias: 3.68,34.16 5.21,34.16 4.45,33.15 5.97,33.15 6.73,34.16 7.49,33.15 8.26,34.16 8.26,32.13 6.73,32.13 5.21,32.13 3.68,32.13 4.45,31.11 5.97,31.11 7.49,31.11 8.26,30.1 6.73,30.1 5.21,30.1 3.68,30.1 4.45,29.08 5.97,29.08 7.49,29.08 8.26,28.07 6.73,28.07
  pour SIGNAL_TOP: 3.84,19.08 3.71,26.34 8.15,26.34 8.13,20.83 6.63,19.08
  pour SIGNAL_TOP: 3.68,29.34 3.68,34.42 8.89,34.42 8.89,26.42 3.68,26.42
  pour GND: 3.43,34.54 9.02,34.54 9.02,24.89 3.43,24.89
M2_POT  (via drill 0.5)
  SIGNAL_TOP 0.406: v11.43,58.17 11.2,58.17 UC.28
  VCC 0.406: MCON_B.P$9 2.08,1.65 2.02,52.25 6.73,56.9 11.43,56.9 v11.43,58.17
M2_PWM  (via drill 0.5)
  SIGNAL_TOP 0.254: UC.13 11.2,46.06 v11.11,45.97
  GND 0.254: R17.2 10.92,45.91 v11.11,45.97
MASTER_WR_BUS_A
  GND 0.254: 19.94,65.18 15.49,65.18 JR2.2 | 19.94,65.28 31.37,65.28
  GND 0.279: COMM.P$5 18.67,60.71 19.94,61.98 | 19.94,61.98 20.7,62.74 RS485.9 | 19.94,61.98 19.94,65.18 19.94,65.28
  GND 0.406: 31.37,65.28 BUS_TERM.P$1
MASTER_WR_BUS_B
  GND 0.279: 27.05,63.37 25.4,63.37 25.4,64.77 20.45,64.77 20.45,63.24 RS485.8 23.88,63.24 23.88,61.59 21.21,61.59 19.94,60.33 19.94,58.93 18.67,57.66 COMM.P$6
  GND 0.406: 27.05,63.37 R_TERM.2
MISO__M1_DIAG_A  (via drill 0.5)
  SIGNAL_TOP 0.254: UC.16 13.59,48.39 17.02,48.39 18.03,49.4 26.04,49.4 26.54,48.89 26.54,47.9 34.04,47.9 | 35.81,47.9 34.16,47.9 34.04,47.9 | 34.04,47.9 PROGRAMMING.P$1
  SIGNAL_TOP 0.406: 35.81,47.9 v35.81,47.24
  GND 0.406: v35.81,47.24 35.94,47.24 R6.2
MOSI__M2_IN_A  (via drill 0.5)
  SIGNAL_TOP 0.254: UC.15 12.8,47.28 13.21,46.86 13.97,46.86 14.99,47.88 17.27,47.88 18.29,48.89 23.37,48.89 v24.26,48.01
  SIGNAL_TOP 0.406: v24.26,48.01 24.26,48.26 | v26.54,53.15 29.46,53.15 PROGRAMMING.P$4
  SIGNAL 0.254: v17.14,45.72 17.14,46.74 18.67,48.26 24,48.26 v24.26,48.01
  GND 0.254: 24.26,53.15 24.26,53.4 26.04,53.4
  GND 0.406: v24.26,48.01 24.26,53.15 | 26.04,53.4 26.29,53.4 v26.54,53.15 | R13.2 17.02,44.41 17.02,45.59 v17.14,45.72
N$2  (via drill 0.5)
  SIGNAL_TOP 0.406: 14.48,44.15 BR2.P$4 14.41,41.53 v14.35,41.53
  GND 0.406: v14.35,41.53 17.14,41.53 R13.1
N$3  (via drill 0.5)
  SIGNAL 0.254: v19.05,62.74 18.54,62.23 v12.57,62.23
  GND 0.254: JR0.1 R2.2 11.81,62.99 v12.57,62.23 | RS485.2 v19.05,62.74
N$4
  GND 0.254: RS485.3 16.38,63.24 16.38,62.48 13.72,62.48 | R3.1 13.72,62.48 | JR1.1 13.72,61.43 13.72,62.48
N$5  (via drill 0.5)
  SIGNAL_TOP 0.406: v31.24,41.53 BR1.P$8
  GND 0.254: v31.24,41.53 30.61,41.53 30.61,43.56 27.43,43.56 27.43,44.64 R11.1 25.27,46.36 R12.1
N$6  (via drill 0.5)
  SIGNAL_TOP 0.406: BR2.P$10 8.41,41.88 v8.64,41.59
  GND 0.406: v8.64,41.59 8.64,42.08 R14.1
N$8  (via drill 0.5)
  SIGNAL_TOP 0.254: BR2.P$9 9.41,45.21 13.4,45.21 13.4,44.15 BR2.P$5
  SIGNAL_TOP 0.406: BR2.P$5 13.46,44.15 | BR2.P$5 13.34,44.15 | BR2.P$5 13.41,41.53 v13.21,41.53
  GND 0.406: R18.2 R15.1 12.95,41.53 v13.21,41.53
N$9  (via drill 0.5)
  SIGNAL_TOP 0.406: BR2.P$7 11.41,42.94 12.07,42.29 v12.07,41.53
  GND 0.406: R17.1 12.07,42.84 v12.07,41.53
N$10  (via drill 0.5)
  SIGNAL_TOP 0.406: v39.12,42.8 39.12,45.34 35.18,45.34 35.18,44.15 BR1.P$4
  GND 0.406: R4.1 39.12,42.71 v39.12,42.8
N$11  (via drill 0.5)
  SIGNAL_TOP 0.406: BR1.P$10 29.24,42 v29.65,41.53
  GND 0.406: v29.65,41.53 29.72,41.95 R5.1
N$12  (via drill 0.5)
  SIGNAL_TOP 0.406: v6.54,59.44 7.43,60.33 8.38,60.33 10,61.94 STATUS.A
  GND 0.406: R7.1 v6.54,59.44
N$13  (via drill 0.5)
  SIGNAL_TOP 0.254: BR1.P$9 30.24,45.28 33.66,45.28 34.23,44.7 34.23,44.17 BR1.P$5
  SIGNAL_TOP 0.406: BR1.P$5 34.24,41.53 v34.29,41.53
  GND 0.406: R9.2 R6.1 | R9.2 34.16,42.58 | R9.2 v34.29,41.53
N$14  (via drill 0.5)
  SIGNAL_TOP 0.406: BR1.P$7 32.24,41.53 v32.51,41.53
  GND 0.406: R8.1 32.51,42.86 v32.51,41.53
N$15  (via drill 0.5)
  SIGNAL_TOP 0.406: BR2.P$8 10.41,42.29 10.67,42.04 10.67,41.78 v10.92,41.53
  GND 0.254: v10.92,41.53 10.03,41.53 10.03,43.56 19.81,43.56 | 19.81,43.56 R20.1 | 19.81,43.56 20.13,43.56 R21.1
N$16
  GND 0.406: BUS_TERM.P$2 30.1,62.36 29.02,63.44 28.83,63.44 27.56,62.17 arc-34 R_TERM.1
OSC1
  SIGNAL_TOP 0.254: 6.47,50.16 7.81,50.16 7.81,49.21 6.98,48.39 6.98,45.4 2.23,45.4 RES.OUTP
  SIGNAL_TOP 0.406: 6.5,50.16 UC.7 6.47,50.16
OSC2
  SIGNAL_TOP 0.406: 6.98,49.4 UC.8 5.49,49.4 RES.INP
PGND  (via drill 1.1)
  SIGNAL_TOP 0.406: BR2.P$28 14.99,25.95 14.99,25.91 | 27.18,25.4 27.18,25.95
  SIGNAL_TOP 0.508: BR2.P$26 13.84,25.95 13.84,25.91 | BR2.P$18 5.84,25.95 5.84,25.91 | 6.98,26.04 6.98,25.95 BR2.P$20 BR2.P$19 6.22,25.95 | 26.67,25.91 26.24,25.91 BR1.P$18 27.18,25.95 | BR1.P$20 28.24,25.91 27.81,25.91 | BR1.P$26 34.24,25.91 34.67,25.91 | BR1.P$28 36.24,25.91 35.81,25.91 | 14.61,25.95 14.61,26.54
  SIGNAL_TOP 1.016: 14.41,25.91 14.99,25.91 | 14.41,25.91 13.84,25.91 | BR2.P$27 14.41,25.91 | 5.84,25.91 6.41,25.91 BR2.P$19 6.41,26.04 | 26.67,25.91 26.67,25.95 27.18,25.95 BR1.P$19 27.81,25.95 27.81,25.91 | 34.67,25.91 34.67,25.95 BR1.P$27 35.81,25.95 35.81,25.91
  SIGNAL_TOP 1.27: POWER_GND.P$3 C11.- | C10.- 11.81,12.45 23.24,12.45 POWER_GND.P$4
  SIGNAL_TOP 1.524: BR2.P$27 14.61,25.95 14.73,25.95 v14.73,24.13 | 35.31,25.95 BR1.P$27 34.42,23.94 v34.42,24 | 6.41,25.91 6.22,25.91 v6.22,24.26 | 27.18,25.4 27.18,24 v27.05,24
  VCC 1.524: v6.22,24.26 6.22,23.24 | v14.73,24.13 14.73,24.57 | v27.05,24 27.11,24.38 | 35.31,24.32 v34.42,24 35.31,23.88
  GND 0.406: v6.22,24.26 2.67,24.26 2.67,36.36 C5.1 | C7.1 39.62,36.74 39.62,24 v34.42,24
  pour VCC: 22.99,2.41 22.99,14.61 14.73,22.86 5.97,22.86 6.03,26.54 35.88,26.54 35.81,2.41
RX  (via drill 0.5)
  SIGNAL_TOP 0.254: v9.53,54.74 9.6,54.74 UC.30
  GND 0.254: RS485.1 17.39,61.43 JR3.1 15.49,60.58 12.57,60.58 12.57,56.9 9.53,56.9 v9.53,54.74
SCK__M2_DIAG_A  (via drill 0.5)
  SIGNAL_TOP 0.254: v16.51,49.28 17.14,49.91 26.8,49.91 27.18,49.53 27.18,48.51 31.75,48.51 31.75,52.2 PROGRAMMING.P$3
  SIGNAL_TOP 0.406: UC.17 16.51,49.4 v16.51,49.28 16.51,49.53
  GND 0.254: 12.95,44.41 12.95,44.96 15.3,46.93 15.3,48.07 v16.51,49.28
  GND 0.406: R15.2 12.95,44.41 | v16.51,49.28 16.64,49.4
SLAVE_WR_BUS_A
  GND 0.254: JR3.2 17.53,59.73 17.53,56.01 19.94,56.01
  GND 0.279: RS485.6 24.89,64.24 24.89,56.01 19.94,56.01 19.94,57.78 20.57,58.42 21.21,58.42 COMM.P$3
SLAVE_WR_BUS_B
  GND 0.279: RS485.7 24.38,63.74 24.38,60.83 22.48,60.83 22.48,57.15 COMM.P$4
TX  (via drill 0.5)
  SIGNAL_TOP 0.254: v9.02,58.17 8.79,58.17 UC.31
  VCC 0.254: v19.05,64.13 10.03,64.13 10.03,58.29 9.02,58.29 v9.02,58.17
  GND 0.254: RS485.4 15.49,63.74 JR2.1 15.84,63.75 19.05,63.75 v19.05,64.13
TX_EN  (via drill 0.5)
  SIGNAL_TOP 0.254: UC.2 6.41,54.1 5.65,54.1 v5.08,53.53
  GND 0.254: R3.2 13.72,66.42 1.4,66.42 1.4,61.09 5.08,57.4 v5.08,53.53
VCC  (via drill 0.5)
  SIGNAL_TOP 0.406: BR2.P$12 6.41,41.66 v6.41,41.53 | BR1.P$12 27.24,41.53 v27.31,41.53
  VCC 0.406: v27.31,41.53 27.31,40.51 6.41,40.51 v6.41,41.53
  GND 0.406: 11.81,22.8 11.81,22.35 FET.S | 11.81,22.8 11.81,23.11 | v6.41,41.53 2.03,41.53 2.03,23.56 4.57,23.56 5.33,22.8 11.81,22.8
  pour GND: 11.68,23.24 19.68,23.24 19.68,1.52 11.43,1.52
VIN
  SIGNAL_TOP 0.254: R19.1 16.3,61.09 22.35,61.09 COMM.P$1
  SIGNAL_TOP 0.406: 27.18,59.69 C1.2 | VREG.1 30.86,58.67 28.96,58.67 VREG.3 27.18,59.82 27.18,59.69 | COMM.P$1 27.18,59.69

### Text on the board
_tsilk: 2 | 1 | MCBMini V4.4 | code.google.com/p/mcbmini | B | A | VCC | PGND
_bsilk: B | A | MB | POT | MB | EA | MA | EB | MA | +5V | GND | GND | +5V | MA | EB | MA | EA | VCC | PGND | MB | POT | MB